# Altium schematic sheet SWITCHING.SchDoc
size 420 x 297 mm; Date: 21/02/2025; Address1: BEE-PC1; SheetNumber: 4; SheetTotal: 4
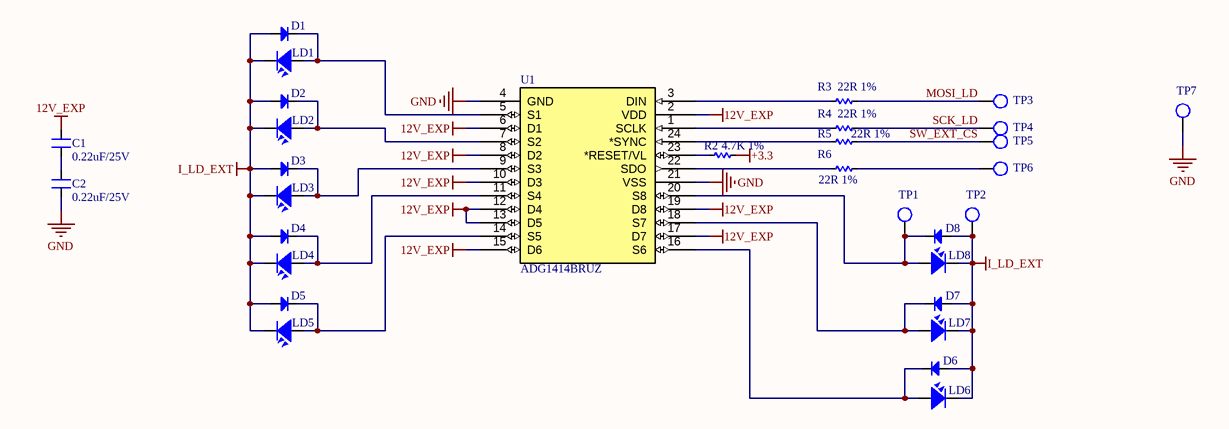
[diagram p0: SWITCHING.SchDoc]

## Parts
C1  0.22uF/25V  [CN-SMD-0603]
C2  0.22uF/25V  [CN-SMD-0603]
D1  1N4148W-TP  [SOD123]  (value not drawn)
D2  1N4148W-TP  [SOD123]  (value not drawn)
D3  1N4148W-TP  [SOD123]  (value not drawn)
D4  1N4148W-TP  [SOD123]  (value not drawn)
D5  1N4148W-TP  [SOD123]  (value not drawn)
D6  1N4148W-TP  [SOD123]  (value not drawn)
D7  1N4148W-TP  [SOD123]  (value not drawn)
D8  1N4148W-TP  [SOD123]  (value not drawn)
LD1  LaserDiode  [LASER_SOCKET]  (value not drawn)
LD2  LaserDiode  [LASER_SOCKET]  (value not drawn)
LD3  LaserDiode  [LASER_SOCKET]  (value not drawn)
LD4  LaserDiode  [LASER_SOCKET]  (value not drawn)
LD5  LaserDiode  [LASER_SOCKET]  (value not drawn)
LD6  LaserDiode  [LASER_SOCKET]  (value not drawn)
LD7  LaserDiode  [LASER_SOCKET]  (value not drawn)
LD8  LaserDiode  [LASER_SOCKET]  (value not drawn)
R2  4.7K 1%  [RES-SMD-0603]
R3  22R 1%  [RES-SMD-0603]
R4  22R 1%  [RES-SMD-0603]
R5  22R 1%  [RES-SMD-0603]
R6  22R 1%  [RES-SMD-0603]
TP1  Test-Point  [TESTPOINT]  (value not drawn)
TP2  Test-Point  [TESTPOINT]  (value not drawn)
TP3  Test-Point  [TESTPOINT]  (value not drawn)
TP4  Test-Point  [TESTPOINT]  (value not drawn)
TP5  Test-Point  [TESTPOINT]  (value not drawn)
TP6  Test-Point  [TESTPOINT]  (value not drawn)
TP7  Test-Point  [TESTPOINT]  (value not drawn)
U1  ADG1414BRUZ  [TSSOP24]

## Nets
12V_EXP: C1.2 U1.2(VDD) U1.6(D1) U1.8(D2) U1.10(D3) U1.12(D4) U1.13(D5) U1.15(D6) U1.17(D7) U1.19(D8)
+3.3: R2.1
GND: C2.1 TP7.1 U1.4(GND) U1.21(VSS)
I_LD_EXT: D1.1(A) D2.1(A) D3.1(A) D4.1(A) D5.1(A) D6.1(A) D7.1(A) D8.1(A) LD1.3 LD2.3 LD3.3 LD4.3 LD5.3 LD6.3 LD7.3 LD8.3 TP2.1
MOSI_LD: R3.1 TP3.1
SCK_LD: R4.1 TP4.1
SW_EXT_CS: R5.1 TP5.1
NetC1_1: C1.1 C2.2
NetD1_2: D1.2(K) LD1.1 U1.5(S1)
NetD2_2: D2.2(K) LD2.1 U1.7(S2)
NetD3_2: D3.2(K) LD3.1 U1.9(S3)
NetD4_2: D4.2(K) LD4.1 U1.11(S4)
NetD5_2: D5.2(K) LD5.1 U1.14(S5)
NetD6_2: D6.2(K) LD6.1 U1.16(S6)
NetD7_2: D7.2(K) LD7.1 U1.18(S7)
NetD8_2: D8.2(K) LD8.1 TP1.1 U1.20(S8)
NetR2_2: R2.2 U1.23(*RESET/VL)
NetR3_2: R3.2 U1.3(DIN)
NetR4_2: R4.2 U1.1(SCLK)
NetR5_2: R5.2 U1.24(*SYNC)
NetR6_1: R6.1 TP6.1
NetR6_2: R6.2 U1.22(SDO)

## Notes on the sheet
- Project:
- BEE-PC1
- Sub-system:
- Design by:
- Hung Nguyen D.
- Bao Bui Q.
- Sheet title:
- Sheet
- A3
- of
- Checked by:
- Approved by:
- Vu Pham
- Revision:
- Document No:
- V1.2.1
- Size:
- Date:

## Library data of the parts
C1 C2 = CN: CAP CER 0.22UF 25V X7R 0603; Value: 33pF
D1-D8 = Diode SMD: DIODE STANDARD 100V 150MA SOD123; Code - JEDEC: DO-214-AB; Value: 1N5007; Published: 8-Jun-2000; Revision: July-2002: Re-released for DXP Platform.; Publisher: Altium Limited
LD1-LD8 = LASER
R2 = Res-SMD: RES SMD 4.7K OHM 1% 1/10W 0603; Manufacturer: Generic Components; Class: Passive; Published: 08/06/2000; Publisher: Altium Hobart Technology Centre
R3-R6 = Res-SMD: Resistor; Manufacturer: Generic Components; Class: Passive; Published: 08/06/2000; Publisher: Altium Hobart Technology Centre
U1 = ADG1414BRUZ: IC SW SPST-NOX8 11.5OHM 24TSSOP